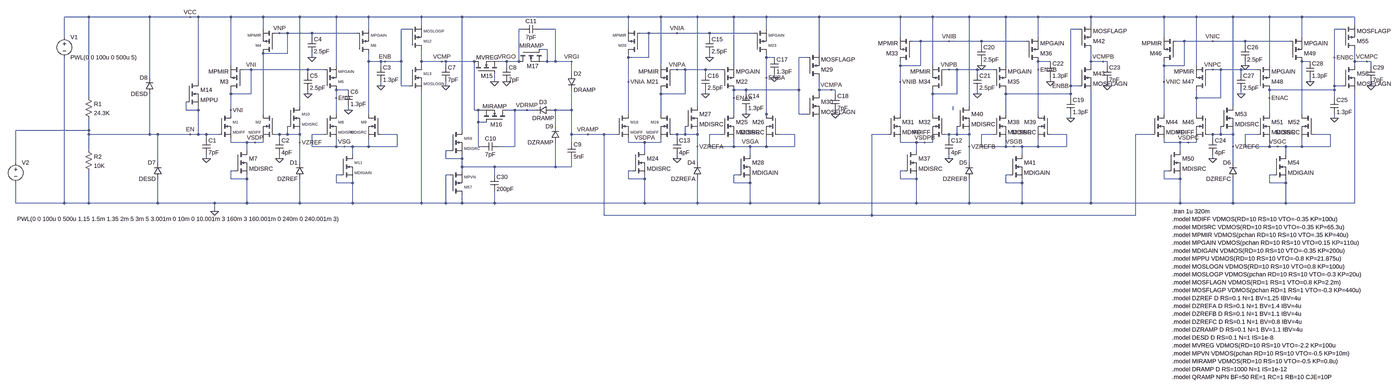
[diagram p0: schematic LM3880.asc, whole sheet]
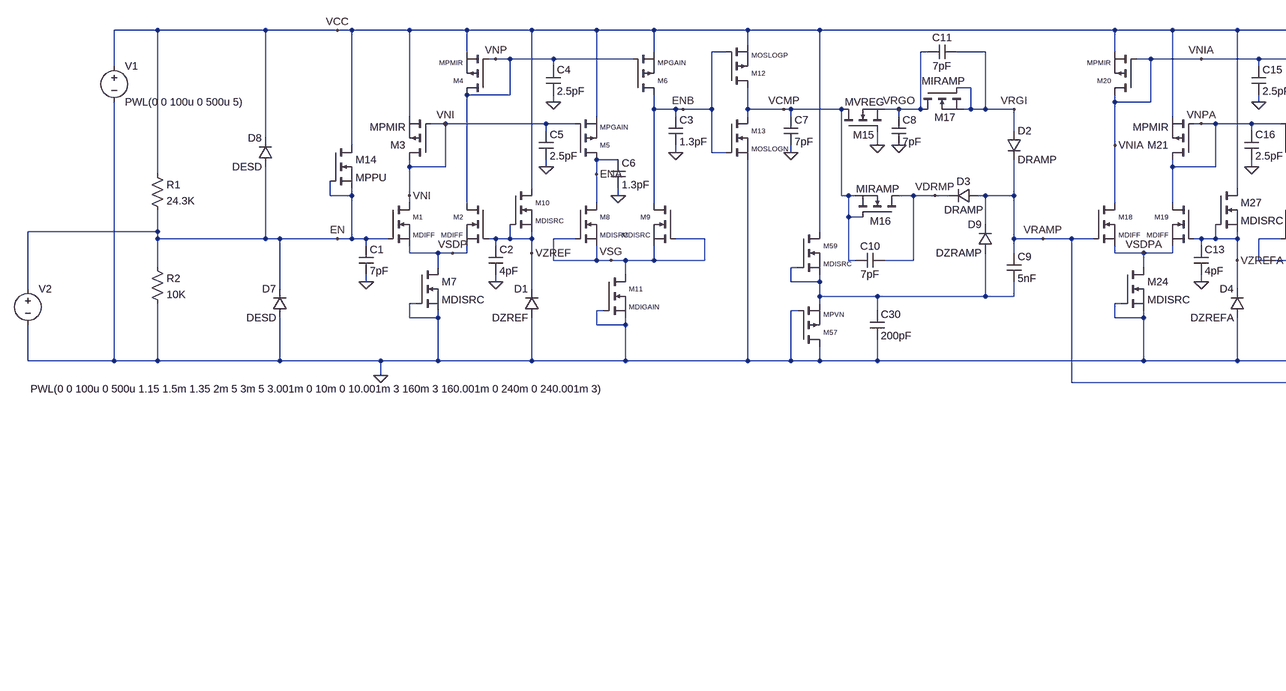
[diagram p1: schematic LM3880.asc, part, row 1 of 1, column 1 of 2]
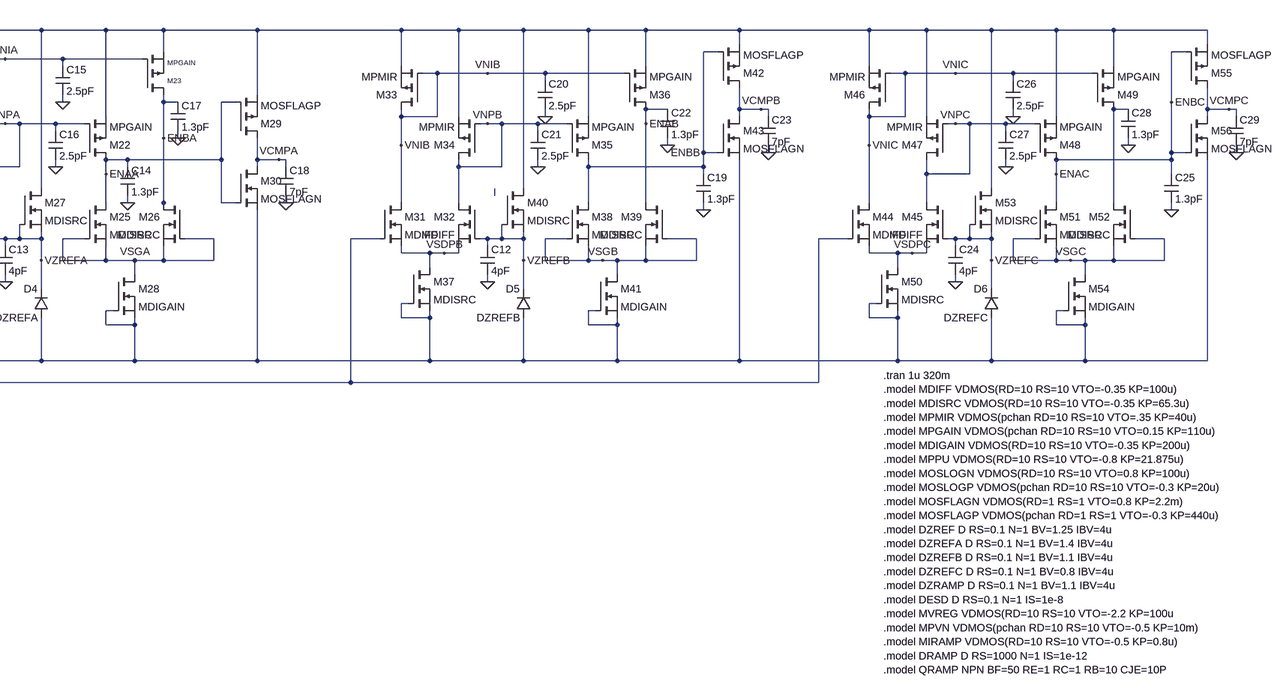
[diagram p2: schematic LM3880.asc, part, row 1 of 1, column 2 of 2]
LM3880.asc, the LTspice schematic file:
Version 4
SHEET 1 4836 1028
WIRE -320 -272 -416 -272
WIRE -80 -272 -320 -272
WIRE 80 -272 -80 -272
WIRE 112 -272 80 -272
WIRE 240 -272 112 -272
WIRE 368 -272 240 -272
WIRE 512 -272 368 -272
WIRE 656 -272 512 -272
WIRE 784 -272 656 -272
WIRE 992 -272 784 -272
WIRE 1152 -272 992 -272
WIRE 1808 -272 1152 -272
WIRE 1936 -272 1808 -272
WIRE 2080 -272 1936 -272
WIRE 2224 -272 2080 -272
WIRE 2352 -272 2224 -272
WIRE 2560 -272 2352 -272
WIRE 2880 -272 2560 -272
WIRE 3008 -272 2880 -272
WIRE 3152 -272 3008 -272
WIRE 3296 -272 3152 -272
WIRE 3424 -272 3296 -272
WIRE 3632 -272 3424 -272
WIRE 3920 -272 3632 -272
WIRE 4048 -272 3920 -272
WIRE 4192 -272 4048 -272
WIRE 4336 -272 4192 -272
WIRE 4464 -272 4336 -272
WIRE 4672 -272 4464 -272
WIRE 992 -240 992 -272
WIRE 3632 -240 3632 -272
WIRE 4672 -240 4672 -272
WIRE 368 -224 368 -272
WIRE 784 -224 784 -272
WIRE 944 -224 912 -224
WIRE 1392 -224 1376 -224
WIRE 1520 -224 1456 -224
WIRE 1808 -224 1808 -272
WIRE 2352 -224 2352 -272
WIRE 3584 -224 3552 -224
WIRE 4624 -224 4592 -224
WIRE 432 -208 416 -208
WIRE 464 -208 432 -208
WIRE 560 -208 464 -208
WIRE 736 -208 560 -208
WIRE 1888 -208 1856 -208
WIRE 2000 -208 1888 -208
WIRE 2128 -208 2000 -208
WIRE 2304 -208 2128 -208
WIRE -416 -192 -416 -272
WIRE 560 -192 560 -208
WIRE 2128 -192 2128 -208
WIRE 2880 -192 2880 -272
WIRE 3424 -192 3424 -272
WIRE 3920 -192 3920 -272
WIRE 4464 -192 4464 -272
WIRE 2960 -176 2928 -176
WIRE 3072 -176 2960 -176
WIRE 3200 -176 3072 -176
WIRE 3376 -176 3200 -176
WIRE 4000 -176 3968 -176
WIRE 4112 -176 4000 -176
WIRE 4240 -176 4112 -176
WIRE 4416 -176 4240 -176
WIRE 3200 -160 3200 -176
WIRE 4240 -160 4240 -176
WIRE 1488 -144 1456 -144
WIRE 464 -128 464 -208
WIRE 464 -128 368 -128
WIRE 2560 -128 2560 -272
WIRE 560 -112 560 -128
WIRE 1808 -112 1808 -128
WIRE 1888 -112 1888 -208
WIRE 1888 -112 1808 -112
WIRE 2128 -112 2128 -128
WIRE 2352 -112 2352 -128
WIRE 2384 -112 2352 -112
WIRE 2512 -112 2480 -112
WIRE 4592 -112 4592 -224
WIRE 784 -96 784 -128
WIRE 832 -96 784 -96
WIRE 848 -96 832 -96
WIRE 912 -96 912 -224
WIRE 912 -96 848 -96
WIRE 992 -96 992 -144
WIRE 1072 -96 992 -96
WIRE 1088 -96 1072 -96
WIRE 1200 -96 1088 -96
WIRE 1328 -96 1296 -96
WIRE 1376 -96 1376 -224
WIRE 1376 -96 1328 -96
WIRE 1488 -96 1488 -144
WIRE 1488 -96 1472 -96
WIRE 1520 -96 1520 -224
WIRE 1520 -96 1488 -96
WIRE 1584 -96 1520 -96
WIRE 3472 -96 3424 -96
WIRE 3632 -96 3632 -144
WIRE 3680 -96 3632 -96
WIRE 3696 -96 3680 -96
WIRE 4496 -96 4464 -96
WIRE 4672 -96 4672 -144
WIRE 4720 -96 4672 -96
WIRE 4736 -96 4720 -96
WIRE 240 -80 240 -272
WIRE 656 -80 656 -272
WIRE 832 -80 832 -96
WIRE 992 -80 992 -96
WIRE 1088 -80 1088 -96
WIRE 1328 -80 1328 -96
WIRE 1936 -80 1936 -272
WIRE 2224 -80 2224 -272
WIRE 2880 -80 2880 -96
WIRE 2960 -80 2960 -176
WIRE 2960 -80 2880 -80
WIRE 3008 -80 3008 -272
WIRE 3200 -80 3200 -96
WIRE 3296 -80 3296 -272
WIRE 3632 -80 3632 -96
WIRE 3696 -80 3696 -96
WIRE 3920 -80 3920 -96
WIRE 4000 -80 4000 -176
WIRE 4000 -80 3920 -80
WIRE 4048 -80 4048 -272
WIRE 4240 -80 4240 -96
WIRE 4336 -80 4336 -272
WIRE 4672 -80 4672 -96
WIRE 4736 -80 4736 -96
WIRE 320 -64 288 -64
WIRE 544 -64 320 -64
WIRE 608 -64 544 -64
WIRE 2000 -64 1984 -64
WIRE 2032 -64 2000 -64
WIRE 2112 -64 2032 -64
WIRE 2176 -64 2112 -64
WIRE 3072 -64 3056 -64
WIRE 3104 -64 3072 -64
WIRE 3184 -64 3104 -64
WIRE 3248 -64 3184 -64
WIRE 3424 -64 3424 -96
WIRE 4112 -64 4096 -64
WIRE 4144 -64 4112 -64
WIRE 4224 -64 4144 -64
WIRE 4288 -64 4224 -64
WIRE 544 -48 544 -64
WIRE 1584 -48 1584 -96
WIRE 2112 -48 2112 -64
WIRE 3184 -48 3184 -64
WIRE 4224 -48 4224 -64
WIRE -80 -32 -80 -272
WIRE 2352 -32 2352 -112
WIRE 2384 -32 2384 -48
WIRE 112 -16 112 -272
WIRE 1280 -16 1280 -48
WIRE 1808 -16 1808 -112
WIRE 2880 -16 2880 -80
WIRE 3472 -16 3472 -32
WIRE 3920 -16 3920 -80
WIRE 4496 -16 4496 -32
WIRE 832 0 832 -16
WIRE 912 0 912 -96
WIRE 944 0 912 0
WIRE 1088 0 1088 -16
WIRE 3552 0 3552 -224
WIRE 3584 0 3552 0
WIRE 3696 0 3696 -16
WIRE 4592 0 4592 -112
WIRE 4624 0 4592 0
WIRE 4736 0 4736 -16
WIRE 704 16 656 16
WIRE 2272 16 2224 16
WIRE 2480 16 2480 -112
WIRE 2480 16 2272 16
WIRE 2560 16 2560 -32
WIRE 2608 16 2560 16
WIRE 2624 16 2608 16
WIRE 4592 16 4592 0
WIRE 4592 16 4336 16
WIRE 240 32 240 16
WIRE 320 32 320 -64
WIRE 320 32 240 32
WIRE 544 32 544 16
WIRE 1936 32 1936 16
WIRE 2032 32 2032 -64
WIRE 2032 32 1936 32
WIRE 2112 32 2112 16
WIRE 2272 32 2272 16
WIRE 2560 32 2560 16
WIRE 2624 32 2624 16
WIRE 3008 32 3008 16
WIRE 3104 32 3104 -64
WIRE 3104 32 3008 32
WIRE 3184 32 3184 16
WIRE 3296 32 3296 16
WIRE 3552 32 3552 0
WIRE 3552 32 3296 32
WIRE 4224 32 4224 16
WIRE -320 48 -320 -272
WIRE 656 48 656 16
WIRE 2224 48 2224 16
WIRE 3552 48 3552 32
WIRE 4048 48 4048 16
WIRE 4144 48 4144 -64
WIRE 4144 48 4048 48
WIRE 4336 48 4336 16
WIRE 4592 48 4592 16
WIRE 512 80 512 -272
WIRE 2080 80 2080 -272
WIRE 3152 80 3152 -272
WIRE 4192 80 4192 -272
WIRE 64 96 64 64
WIRE 112 96 112 80
WIRE 112 96 64 96
WIRE 240 96 240 32
WIRE 704 96 704 80
WIRE 1200 96 1200 -96
WIRE 1216 96 1200 96
WIRE 1232 96 1216 96
WIRE 1360 96 1328 96
WIRE 1408 96 1360 96
WIRE 1440 96 1408 96
WIRE 1520 96 1504 96
WIRE 1584 96 1584 16
WIRE 1584 96 1520 96
WIRE 3088 96 3088 80
WIRE 240 112 240 96
WIRE 368 112 368 -128
WIRE 656 112 656 48
WIRE 784 112 784 -96
WIRE 1808 112 1808 -16
WIRE 1936 112 1936 32
WIRE 2224 112 2224 48
WIRE 2272 112 2272 96
WIRE 2352 112 2352 -32
WIRE 2480 112 2480 16
WIRE 2512 112 2480 112
WIRE 2624 112 2624 96
WIRE 2880 112 2880 -16
WIRE 3008 112 3008 32
WIRE 3296 112 3296 32
WIRE 3424 112 3424 -64
WIRE 3920 112 3920 -16
WIRE 4048 112 4048 48
WIRE 4336 112 4336 48
WIRE 4464 112 4464 -96
WIRE 2352 128 2352 112
WIRE 3552 128 3552 112
WIRE 4592 128 4592 112
WIRE 1216 144 1216 96
WIRE 1248 144 1216 144
WIRE 1520 160 1520 96
WIRE -320 176 -320 128
WIRE -320 176 -608 176
WIRE 1152 176 1152 -272
WIRE -320 192 -320 176
WIRE -80 192 -80 32
WIRE -80 192 -320 192
WIRE -48 192 -80 192
WIRE 80 192 -48 192
WIRE 112 192 112 96
WIRE 112 192 80 192
WIRE 144 192 112 192
WIRE 192 192 144 192
WIRE 432 192 416 192
WIRE 464 192 464 160
WIRE 464 192 432 192
WIRE 512 192 512 176
WIRE 512 192 464 192
WIRE 608 192 560 192
WIRE 896 192 832 192
WIRE 1584 192 1584 96
WIRE 1648 192 1584 192
WIRE 1712 192 1648 192
WIRE 1760 192 1712 192
WIRE 2000 192 1984 192
WIRE 2032 192 2032 160
WIRE 2032 192 2000 192
WIRE 2080 192 2080 176
WIRE 2080 192 2032 192
WIRE 2176 192 2128 192
WIRE 2464 192 2400 192
WIRE 2832 192 2768 192
WIRE 3072 192 3056 192
WIRE 3104 192 3104 160
WIRE 3104 192 3072 192
WIRE 3152 192 3152 176
WIRE 3152 192 3104 192
WIRE 3248 192 3200 192
WIRE 3536 192 3472 192
WIRE 3872 192 3808 192
WIRE 4112 192 4096 192
WIRE 4144 192 4144 160
WIRE 4144 192 4112 192
WIRE 4192 192 4192 176
WIRE 4192 192 4144 192
WIRE 4288 192 4240 192
WIRE 4576 192 4512 192
WIRE 144 208 144 192
WIRE 432 208 432 192
WIRE 2000 208 2000 192
WIRE 3072 208 3072 192
WIRE 4112 208 4112 192
WIRE 240 224 240 208
WIRE 304 224 240 224
WIRE 336 224 304 224
WIRE 368 224 368 208
WIRE 368 224 336 224
WIRE 512 224 512 192
WIRE 1584 224 1584 192
WIRE 1808 224 1808 208
WIRE 1872 224 1808 224
WIRE 1936 224 1936 208
WIRE 1936 224 1872 224
WIRE 2880 224 2880 208
WIRE 2944 224 2880 224
WIRE 2976 224 2944 224
WIRE 3008 224 3008 208
WIRE 3008 224 2976 224
WIRE 3920 224 3920 208
WIRE 3984 224 3920 224
WIRE 4016 224 3984 224
WIRE 4048 224 4048 208
WIRE 4048 224 4016 224
WIRE 560 240 560 192
WIRE 656 240 656 208
WIRE 656 240 560 240
WIRE 688 240 656 240
WIRE 720 240 688 240
WIRE 784 240 784 208
WIRE 784 240 720 240
WIRE 896 240 896 192
WIRE 896 240 784 240
WIRE 1216 240 1216 144
WIRE 1232 240 1216 240
WIRE 1360 240 1360 96
WIRE 1360 240 1296 240
WIRE 2080 240 2080 192
WIRE 2128 240 2128 192
WIRE 2224 240 2224 208
WIRE 2224 240 2128 240
WIRE 2288 240 2224 240
WIRE 2352 240 2352 208
WIRE 2352 240 2288 240
WIRE 2464 240 2464 192
WIRE 2464 240 2352 240
WIRE 3152 240 3152 192
WIRE 3200 240 3200 192
WIRE 3296 240 3296 208
WIRE 3296 240 3200 240
WIRE 3328 240 3296 240
WIRE 3360 240 3328 240
WIRE 3424 240 3424 208
WIRE 3424 240 3360 240
WIRE 3536 240 3536 192
WIRE 3536 240 3424 240
WIRE 4192 240 4192 192
WIRE 4240 240 4240 192
WIRE 4336 240 4336 208
WIRE 4336 240 4240 240
WIRE 4368 240 4336 240
WIRE 4400 240 4368 240
WIRE 4464 240 4464 208
WIRE 4464 240 4400 240
WIRE 4576 240 4576 192
WIRE 4576 240 4464 240
WIRE -320 256 -320 192
WIRE 304 256 304 224
WIRE 1104 256 1088 256
WIRE 1872 256 1872 224
WIRE 2944 256 2944 224
WIRE 3984 256 3984 224
WIRE 720 272 720 240
WIRE 2288 272 2288 240
WIRE 3360 272 3360 240
WIRE 4400 272 4400 240
WIRE 144 288 144 272
WIRE 432 288 432 272
WIRE 1088 288 1088 256
WIRE 1152 288 1152 272
WIRE 1152 288 1088 288
WIRE 2000 288 2000 272
WIRE 3072 288 3072 272
WIRE 4112 288 4112 272
WIRE -608 304 -608 176
WIRE -48 304 -48 192
WIRE 512 304 512 224
WIRE 2080 304 2080 240
WIRE 3152 304 3152 240
WIRE 4192 304 4192 240
WIRE 1152 320 1152 288
WIRE 1280 320 1152 320
WIRE 1520 320 1520 224
WIRE 1520 320 1280 320
WIRE 1584 320 1584 288
WIRE 1584 320 1520 320
WIRE 256 336 240 336
WIRE 1152 336 1152 320
WIRE 1824 336 1808 336
WIRE 2896 336 2880 336
WIRE 3936 336 3920 336
WIRE 672 352 656 352
WIRE 1104 352 1088 352
WIRE 1280 352 1280 320
WIRE 2240 352 2224 352
WIRE 3312 352 3296 352
WIRE 4352 352 4336 352
WIRE 240 368 240 336
WIRE 304 368 304 352
WIRE 304 368 240 368
WIRE 1808 368 1808 336
WIRE 1872 368 1872 352
WIRE 1872 368 1808 368
WIRE 2880 368 2880 336
WIRE 2944 368 2944 352
WIRE 2944 368 2880 368
WIRE 3920 368 3920 336
WIRE 3984 368 3984 352
WIRE 3984 368 3920 368
WIRE 656 384 656 352
WIRE 720 384 720 368
WIRE 720 384 656 384
WIRE 2224 384 2224 352
WIRE 2288 384 2288 368
WIRE 2288 384 2224 384
WIRE 3296 384 3296 352
WIRE 3360 384 3360 368
WIRE 3360 384 3296 384
WIRE 4336 384 4336 352
WIRE 4400 384 4400 368
WIRE 4400 384 4336 384
WIRE -608 464 -608 384
WIRE -416 464 -416 -112
WIRE -416 464 -608 464
WIRE -320 464 -320 336
WIRE -320 464 -416 464
WIRE -48 464 -48 368
WIRE -48 464 -320 464
WIRE 176 464 -48 464
WIRE 304 464 304 368
WIRE 304 464 176 464
WIRE 512 464 512 368
WIRE 512 464 304 464
WIRE 720 464 720 384
WIRE 720 464 512 464
WIRE 992 464 992 16
WIRE 992 464 720 464
WIRE 1088 464 1088 352
WIRE 1088 464 992 464
WIRE 1152 464 1152 432
WIRE 1152 464 1088 464
WIRE 1280 464 1280 416
WIRE 1280 464 1152 464
WIRE 1872 464 1872 368
WIRE 1872 464 1280 464
WIRE 2080 464 2080 368
WIRE 2080 464 1872 464
WIRE 2288 464 2288 384
WIRE 2288 464 2080 464
WIRE 2560 464 2560 128
WIRE 2560 464 2288 464
WIRE 2944 464 2944 368
WIRE 2944 464 2560 464
WIRE 3152 464 3152 368
WIRE 3152 464 2944 464
WIRE 3360 464 3360 384
WIRE 3360 464 3152 464
WIRE 3632 464 3632 16
WIRE 3632 464 3360 464
WIRE 3984 464 3984 368
WIRE 3984 464 3632 464
WIRE 4192 464 4192 368
WIRE 4192 464 3984 464
WIRE 4400 464 4400 384
WIRE 4400 464 4192 464
WIRE 4672 464 4672 16
WIRE 4672 464 4400 464
WIRE 176 496 176 464
WIRE 1712 512 1712 192
WIRE 2768 512 2768 192
WIRE 2768 512 1712 512
WIRE 3808 512 3808 192
WIRE 3808 512 2768 512
FLAG 80 192 EN
FLAG 80 -272 VCC
FLAG 848 -96 ENB
FLAG 336 224 VSDP
FLAG 240 96 VNI
FLAG 320 -64 VNI
FLAG 176 496 0
FLAG 512 224 VZREF
FLAG 656 48 ENA
FLAG 1072 -96 VCMP
FLAG 432 -208 VNP
FLAG 688 240 VSG
FLAG 144 288 0
FLAG 560 -112 0
FLAG 544 32 0
FLAG 832 0 0
FLAG 704 96 0
FLAG 432 288 0
FLAG 1280 -16 0
FLAG 1088 0 0
FLAG 1328 -16 0
FLAG 1328 -96 VRGO
FLAG 1584 -96 VRGI
FLAG 1408 96 VDRMP
FLAG 1872 224 VSDPA
FLAG 1808 -16 VNIA
FLAG 2000 -208 VNIA
FLAG 2080 240 VZREFA
FLAG 2224 48 ENAA
FLAG 2608 16 VCMPA
FLAG 2000 -64 VNPA
FLAG 2288 240 VSGA
FLAG 2128 -112 0
FLAG 2112 32 0
FLAG 2272 112 0
FLAG 2384 -32 0
FLAG 2000 288 0
FLAG 2624 112 0
FLAG 3552 0 ENBB
FLAG 2976 224 VSDPB
FLAG 2880 -16 VNIB
FLAG 3072 -176 VNIB
FLAG 3152 240 VZREFB
FLAG 3424 -64 ENAB
FLAG 3680 -96 VCMPB
FLAG 3072 -64 VNPB
FLAG 3328 240 VSGB
FLAG 3200 -80 0
FLAG 3184 32 0
FLAG 3552 128 0
FLAG 3472 -16 0
FLAG 3072 288 0
FLAG 3696 0 0
FLAG 4016 224 VSDPC
FLAG 3920 -16 VNIC
FLAG 4112 -176 VNIC
FLAG 4192 240 VZREFC
FLAG 4336 48 ENAC
FLAG 4720 -96 VCMPC
FLAG 4112 -64 VNPC
FLAG 4368 240 VSGC
FLAG 4240 -80 0
FLAG 4224 32 0
FLAG 4592 128 0
FLAG 4496 -16 0
FLAG 4112 288 0
FLAG 4736 0 0
FLAG 1648 192 VRAMP
FLAG 2352 -32 ENBA
FLAG 4592 -112 ENBC
SYMBOL nmos 192 112 R0
WINDOW 3 56 72 Left 1
WINDOW 0 56 32 Left 1
SYMATTR Value MDIFF
SYMATTR InstName M1
SYMBOL nmos 416 112 M0
WINDOW 3 56 72 Left 1
WINDOW 0 56 32 Left 1
SYMATTR Value MDIFF
SYMATTR InstName M2
SYMBOL diode 528 368 R180
WINDOW 0 24 64 Left 2
WINDOW 3 24 0 Left 2
SYMATTR InstName D1
SYMATTR Value DZREF
SYMBOL pmos 288 16 R180
WINDOW 0 56 32 Left 2
WINDOW 3 56 72 Left 2
SYMATTR InstName M3
SYMATTR Value MPMIR
SYMBOL pmos 416 -128 R180
WINDOW 0 56 32 Left 1
WINDOW 3 56 72 Left 1
SYMATTR InstName M4
SYMATTR Value MPMIR
SYMBOL pmos 608 16 M180
WINDOW 0 56 32 Left 1
WINDOW 3 56 72 Left 1
SYMATTR InstName M5
SYMATTR Value MPGAIN
SYMBOL pmos 736 -128 M180
WINDOW 0 56 32 Left 1
WINDOW 3 56 72 Left 1
SYMATTR InstName M6
SYMATTR Value MPGAIN
SYMBOL nmos 256 256 R0
SYMATTR InstName M7
SYMATTR Value MDISRC
SYMBOL nmos 608 112 R0
WINDOW 0 56 32 Left 1
WINDOW 3 56 72 Left 1
SYMATTR InstName M8
SYMATTR Value MDISRC
SYMBOL nmos 832 112 M0
WINDOW 0 56 32 Left 1
WINDOW 3 56 72 Left 1
SYMATTR InstName M9
SYMATTR Value MDISRC
SYMBOL voltage -416 -208 R0
SYMATTR InstName V1
SYMATTR Value PWL(0 0 100u 0 500u 5)
SYMBOL nmos 464 80 R0
WINDOW 0 56 32 Left 1
WINDOW 3 56 72 Left 1
SYMATTR InstName M10
SYMATTR Value MDISRC
SYMBOL res -336 32 R0
WINDOW 0 36 40 Left 2
WINDOW 3 36 76 Left 2
SYMATTR InstName R1
SYMATTR Value 24.3K
SYMBOL res -336 240 R0
WINDOW 0 36 40 Left 2
WINDOW 3 36 76 Left 2
SYMATTR InstName R2
SYMATTR Value 10K
SYMBOL nmos 672 272 R0
WINDOW 0 56 32 Left 1
WINDOW 3 56 72 Left 1
SYMATTR InstName M11
SYMATTR Value MDIGAIN
SYMBOL voltage -608 288 R0
WINDOW 3 6 238 Left 2
SYMATTR Value PWL(0 0 100u 0 500u 1.15 1.5m 1.35 2m 5 3m 5 3.001m 0 10m 0 10.001m 3 160m 3 160.001m 0 240m 0 240.001m 3)
SYMATTR InstName V2
SYMBOL pmos 944 -144 M180
WINDOW 0 56 32 Left 1
WINDOW 3 56 72 Left 1
SYMATTR InstName M12
SYMATTR Value MOSLOGP
SYMBOL nmos 944 -80 R0
WINDOW 0 56 32 Left 1
WINDOW 3 56 72 Left 1
SYMATTR InstName M13
SYMATTR Value MOSLOGN
SYMBOL nmos 64 -16 R0
WINDOW 0 56 32 Left 2
WINDOW 3 56 72 Left 2
SYMATTR InstName M14
SYMATTR Value MPPU
SYMBOL cap 128 208 R0
SYMATTR InstName C1
SYMATTR Value 7pF
SYMBOL cap 416 208 R0
SYMATTR InstName C2
SYMATTR Value 4pF
SYMBOL cap 816 -80 R0
SYMATTR InstName C3
SYMATTR Value 1.3pF
SYMBOL cap 544 -192 R0
SYMATTR InstName C4
SYMATTR Value 2.5pF
SYMBOL cap 528 -48 R0
SYMATTR InstName C5
SYMATTR Value 2.5pF
SYMBOL cap 688 16 R0
SYMATTR InstName C6
SYMATTR Value 1.3pF
SYMBOL nmos 1200 -48 R270
WINDOW 0 -9 26 VRight 2
WINDOW 3 64 8 VRight 2
SYMATTR InstName M15
SYMATTR Value MVREG
SYMBOL cap 1072 -80 R0
SYMATTR InstName C7
SYMATTR Value 7pF
SYMBOL cap 1312 -80 R0
SYMATTR InstName C8
SYMATTR Value 7pF
SYMBOL cap 1568 224 R0
SYMATTR InstName C9
SYMATTR Value 5nF
SYMBOL diode 1568 -48 R0
SYMATTR InstName D2
SYMATTR Value DRAMP
SYMBOL nmos 1328 144 M270
WINDOW 0 -9 64 VLeft 2
WINDOW 3 63 95 VLeft 2
SYMATTR InstName M16
SYMATTR Value MIRAMP
SYMBOL nmos 1376 -144 M90
WINDOW 0 66 78 VLeft 2
WINDOW 3 -15 99 VLeft 2
SYMATTR InstName M17
SYMATTR Value MIRAMP
SYMBOL diode 1504 80 R90
WINDOW 0 0 32 VBottom 2
WINDOW 3 32 32 VTop 2
SYMATTR InstName D3
SYMATTR Value DRAMP
SYMBOL cap 1296 224 R90
WINDOW 0 0 32 VBottom 2
WINDOW 3 32 32 VTop 2
SYMATTR InstName C10
SYMATTR Value 7pF
SYMBOL cap 1456 -240 R90
WINDOW 0 0 32 VBottom 2
WINDOW 3 32 32 VTop 2
SYMATTR InstName C11
SYMATTR Value 7pF
SYMBOL nmos 1760 112 R0
WINDOW 0 56 32 Left 1
WINDOW 3 56 72 Left 1
SYMATTR InstName M18
SYMATTR Value MDIFF
SYMBOL nmos 1984 112 M0
WINDOW 0 56 32 Left 1
WINDOW 3 56 72 Left 1
SYMATTR InstName M19
SYMATTR Value MDIFF
SYMBOL diode 2096 368 R180
WINDOW 0 24 64 Left 2
WINDOW 3 24 0 Left 2
SYMATTR InstName D4
SYMATTR Value DZREFA
SYMBOL pmos 1856 -128 R180
WINDOW 0 56 32 Left 1
WINDOW 3 56 72 Left 1
SYMATTR InstName M20
SYMATTR Value MPMIR
SYMBOL pmos 1984 16 R180
SYMATTR InstName M21
SYMATTR Value MPMIR
SYMBOL pmos 2176 16 M180
SYMATTR InstName M22
SYMATTR Value MPGAIN
SYMBOL pmos 2304 -128 M180
WINDOW 0 56 32 Left 1
WINDOW 3 56 72 Left 1
SYMATTR InstName M23
SYMATTR Value MPGAIN
SYMBOL nmos 1824 256 R0
SYMATTR InstName M24
SYMATTR Value MDISRC
SYMBOL nmos 2176 112 R0
SYMATTR InstName M25
SYMATTR Value MDISRC
SYMBOL nmos 2400 112 M0
SYMATTR InstName M26
SYMATTR Value MDISRC
SYMBOL nmos 2032 80 R0
SYMATTR InstName M27
SYMATTR Value MDISRC
SYMBOL nmos 2240 272 R0
SYMATTR InstName M28
SYMATTR Value MDIGAIN
SYMBOL pmos 2512 -32 M180
SYMATTR InstName M29
SYMATTR Value MOSFLAGP
SYMBOL nmos 2512 32 R0
SYMATTR InstName M30
SYMATTR Value MOSFLAGN
SYMBOL cap 1984 208 R0
SYMATTR InstName C13
SYMATTR Value 4pF
SYMBOL cap 2256 32 R0
SYMATTR InstName C14
SYMATTR Value 1.3pF
SYMBOL cap 2112 -192 R0
SYMATTR InstName C15
SYMATTR Value 2.5pF
SYMBOL cap 2096 -48 R0
SYMATTR InstName C16
SYMATTR Value 2.5pF
SYMBOL cap 2368 -112 R0
SYMATTR InstName C17
SYMATTR Value 1.3pF
SYMBOL cap 2608 32 R0
SYMATTR InstName C18
SYMATTR Value 7pF
SYMBOL nmos 2832 112 R0
SYMATTR InstName M31
SYMATTR Value MDIFF
SYMBOL nmos 3056 112 M0
SYMATTR InstName M32
SYMATTR Value MDIFF
SYMBOL diode 3168 368 R180
WINDOW 0 24 64 Left 2
WINDOW 3 24 0 Left 2
SYMATTR InstName D5
SYMATTR Value DZREFB
SYMBOL pmos 2928 -96 R180
SYMATTR InstName M33
SYMATTR Value MPMIR
SYMBOL pmos 3056 16 R180
SYMATTR InstName M34
SYMATTR Value MPMIR
SYMBOL pmos 3248 16 M180
SYMATTR InstName M35
SYMATTR Value MPGAIN
SYMBOL pmos 3376 -96 M180
SYMATTR InstName M36
SYMATTR Value MPGAIN
SYMBOL nmos 2896 256 R0
SYMATTR InstName M37
SYMATTR Value MDISRC
SYMBOL nmos 3248 112 R0
SYMATTR InstName M38
SYMATTR Value MDISRC
SYMBOL nmos 3472 112 M0
SYMATTR InstName M39
SYMATTR Value MDISRC
SYMBOL nmos 3104 80 R0
SYMATTR InstName M40
SYMATTR Value MDISRC
SYMBOL nmos 3312 272 R0
SYMATTR InstName M41
SYMATTR Value MDIGAIN
SYMBOL pmos 3584 -144 M180
SYMATTR InstName M42
SYMATTR Value MOSFLAGP
SYMBOL nmos 3584 -80 R0
SYMATTR InstName M43
SYMATTR Value MOSFLAGN
SYMBOL cap 3056 208 R0
SYMATTR InstName C12
SYMATTR Value 4pF
SYMBOL cap 3536 48 R0
SYMATTR InstName C19
SYMATTR Value 1.3pF
SYMBOL cap 3184 -160 R0
SYMATTR InstName C20
SYMATTR Value 2.5pF
SYMBOL cap 3168 -48 R0
SYMATTR InstName C21
SYMATTR Value 2.5pF
SYMBOL cap 3456 -96 R0
SYMATTR InstName C22
SYMATTR Value 1.3pF
SYMBOL cap 3680 -80 R0
SYMATTR InstName C23
SYMATTR Value 7pF
SYMBOL nmos 3872 112 R0
SYMATTR InstName M44
SYMATTR Value MDIFF
SYMBOL nmos 4096 112 M0
SYMATTR InstName M45
SYMATTR Value MDIFF
SYMBOL diode 4208 368 R180
WINDOW 0 24 64 Left 2
WINDOW 3 24 0 Left 2
SYMATTR InstName D6
SYMATTR Value DZREFC
SYMBOL pmos 3968 -96 R180
SYMATTR InstName M46
SYMATTR Value MPMIR
SYMBOL pmos 4096 16 R180
SYMATTR InstName M47
SYMATTR Value MPMIR
SYMBOL pmos 4288 16 M180
SYMATTR InstName M48
SYMATTR Value MPGAIN
SYMBOL pmos 4416 -96 M180
SYMATTR InstName M49
SYMATTR Value MPGAIN
SYMBOL nmos 3936 256 R0
SYMATTR InstName M50
SYMATTR Value MDISRC
SYMBOL nmos 4288 112 R0
SYMATTR InstName M51
SYMATTR Value MDISRC
SYMBOL nmos 4512 112 M0
SYMATTR InstName M52
SYMATTR Value MDISRC
SYMBOL nmos 4144 80 R0
SYMATTR InstName M53
SYMATTR Value MDISRC
SYMBOL nmos 4352 272 R0
SYMATTR InstName M54
SYMATTR Value MDIGAIN
SYMBOL pmos 4624 -144 M180
SYMATTR InstName M55
SYMATTR Value MOSFLAGP
SYMBOL nmos 4624 -80 R0
SYMATTR InstName M56
SYMATTR Value MOSFLAGN
SYMBOL cap 4096 208 R0
SYMATTR InstName C24
SYMATTR Value 4pF
SYMBOL cap 4576 48 R0
SYMATTR InstName C25
SYMATTR Value 1.3pF
SYMBOL cap 4224 -160 R0
SYMATTR InstName C26
SYMATTR Value 2.5pF
SYMBOL cap 4208 -48 R0
SYMATTR InstName C27
SYMATTR Value 2.5pF
SYMBOL cap 4480 -96 R0
SYMATTR InstName C28
SYMATTR Value 1.3pF
SYMBOL cap 4720 -80 R0
SYMATTR InstName C29
SYMATTR Value 7pF
SYMBOL diode -32 368 R180
WINDOW 0 24 64 Left 2
WINDOW 3 24 0 Left 2
SYMATTR InstName D7
SYMATTR Value DESD
SYMBOL diode -64 32 R180
WINDOW 0 24 64 Left 2
WINDOW 3 24 0 Left 2
SYMATTR InstName D8
SYMATTR Value DESD
SYMBOL diode 1536 224 R180
WINDOW 0 24 64 Left 2
WINDOW 3 24 0 Left 2
SYMATTR InstName D9
SYMATTR Value DZRAMP
SYMBOL pmos 1104 432 M180
WINDOW 0 56 32 Left 1
WINDOW 3 56 72 Left 1
SYMATTR InstName M57
SYMATTR Value MPVN
SYMBOL cap 1264 352 R0
SYMATTR InstName C30
SYMATTR Value 200pF
SYMBOL nmos 1104 176 R0
WINDOW 0 56 32 Left 1
WINDOW 3 56 72 Left 1
SYMATTR InstName M59
SYMATTR Value MDISRC
TEXT 3952 496 Left 2 !.tran 1u 320m\n.model MDIFF VDMOS(RD=10 RS=10 VTO=-0.35 KP=100u)\n.model MDISRC VDMOS(RD=10 RS=10 VTO=-0.35 KP=65.3u)\n.model MPMIR VDMOS(pchan RD=10 RS=10 VTO=.35 KP=40u)\n.model MPGAIN VDMOS(pchan RD=10 RS=10 VTO=0.15 KP=110u)\n.model MDIGAIN VDMOS(RD=10 RS=10 VTO=-0.35 KP=200u)\n.model MPPU VDMOS(RD=10 RS=10 VTO=-0.8 KP=21.875u)\n.model MOSLOGN VDMOS(RD=10 RS=10 VTO=0.8 KP=100u)\n.model MOSLOGP VDMOS(pchan RD=10 RS=10 VTO=-0.3 KP=20u)\n.model MOSFLAGN VDMOS(RD=1 RS=1 VTO=0.8 KP=2.2m)\n.model MOSFLAGP VDMOS(pchan RD=1 RS=1 VTO=-0.3 KP=440u)\n.model DZREF D RS=0.1 N=1 BV=1.25 IBV=4u\n.model DZREFA D RS=0.1 N=1 BV=1.4 IBV=4u\n.model DZREFB D RS=0.1 N=1 BV=1.1 IBV=4u\n.model DZREFC D RS=0.1 N=1 BV=0.8 IBV=4u\n.model DZRAMP D RS=0.1 N=1 BV=1.1 IBV=4u\n.model DESD D RS=0.1 N=1 IS=1e-8\n.model MVREG VDMOS(RD=10 RS=10 VTO=-2.2 KP=100u\n.model MPVN VDMOS(pchan RD=10 RS=10 VTO=-0.5 KP=10m)\n.model MIRAMP VDMOS(RD=10 RS=10 VTO=-0.5 KP=0.8u)\n.model DRAMP D RS=1000 N=1 IS=1e-12\n.model QRAMP NPN BF=50 RE=1 RC=1 RB=10 CJE=10P

The netlist it stands for:
* LM3880.asc
M1 VNI EN VSDP VSDP MDIFF
M2 VNP VZREF VSDP VSDP MDIFF
D1 0 VZREF DZREF
M3 VNI VNI VCC VCC MPMIR
M4 VNP VNP VCC VCC MPMIR
M5 ENA VNI VCC VCC MPGAIN
M6 ENB VNP VCC VCC MPGAIN
M7 VSDP 0 0 0 MDISRC
M8 ENA VSG VSG VSG MDISRC
M9 ENB VSG VSG VSG MDISRC
V1 VCC 0 PWL(0 0 100u 0 500u 5)
M10 VCC VZREF VZREF VZREF MDISRC
R1 VCC EN 24.3K
R2 EN 0 10K
M11 VSG 0 0 0 MDIGAIN
V2 EN 0 PWL(0 0 100u 0 500u 1.15 1.5m 1.35 2m 5 3m 5 3.001m 0 10m 0 10.001m 3 160m 3 160.001m 0 240m 0 240.001m 3)
M12 VCMP ENB VCC VCC MOSLOGP
M13 VCMP ENB 0 0 MOSLOGN
M14 VCC EN EN EN MPPU
C1 EN 0 7pF
C2 VZREF 0 4pF
C3 ENB 0 1.3pF
C4 VNP 0 2.5pF
C5 VNI 0 2.5pF
C6 ENA 0 1.3pF
M15 VCMP 0 VRGO VRGO MVREG
C7 VCMP 0 7pF
C8 VRGO 0 7pF
C9 VRAMP N003 5nF
D2 VRGI VRAMP DRAMP
M16 VDRMP VCMP VCMP VCMP MIRAMP
M17 VRGO VRGI VRGI VRGI MIRAMP
D3 VRAMP VDRMP DRAMP
C10 VDRMP VCMP 7pF
C11 VRGI VRGO 7pF
M18 VNIA VRAMP VSDPA VSDPA MDIFF
M19 VNPA VZREFA VSDPA VSDPA MDIFF
D4 0 VZREFA DZREFA
M20 VNIA VNIA VCC VCC MPMIR
M21 VNPA VNPA VCC VCC MPMIR
M22 ENAA VNPA VCC VCC MPGAIN
M23 ENBA VNIA VCC VCC MPGAIN
M24 VSDPA 0 0 0 MDISRC
M25 ENAA VSGA VSGA VSGA MDISRC
M26 ENBA VSGA VSGA VSGA MDISRC
M27 VCC VZREFA VZREFA VZREFA MDISRC
M28 VSGA 0 0 0 MDIGAIN
M29 VCMPA ENAA VCC VCC MOSFLAGP
M30 VCMPA ENAA 0 0 MOSFLAGN
C13 VZREFA 0 4pF
C14 ENAA 0 1.3pF
C15 VNIA 0 2.5pF
C16 VNPA 0 2.5pF
C17 ENBA 0 1.3pF
C18 VCMPA 0 7pF
M31 VNIB VRAMP VSDPB VSDPB MDIFF
M32 VNPB VZREFB VSDPB VSDPB MDIFF
D5 0 VZREFB DZREFB
M33 VNIB VNIB VCC VCC MPMIR
M34 VNPB VNPB VCC VCC MPMIR
M35 ENBB VNPB VCC VCC MPGAIN
M36 ENAB VNIB VCC VCC MPGAIN
M37 VSDPB 0 0 0 MDISRC
M38 ENBB VSGB VSGB VSGB MDISRC
M39 ENAB VSGB VSGB VSGB MDISRC
M40 VCC VZREFB VZREFB VZREFB MDISRC
M41 VSGB 0 0 0 MDIGAIN
M42 VCMPB ENBB VCC VCC MOSFLAGP
M43 VCMPB ENBB 0 0 MOSFLAGN
C12 VZREFB 0 4pF
C19 ENBB 0 1.3pF
C20 VNIB 0 2.5pF
C21 VNPB 0 2.5pF
C22 ENAB 0 1.3pF
C23 VCMPB 0 7pF
M44 VNIC VRAMP VSDPC VSDPC MDIFF
M45 VNPC VZREFC VSDPC VSDPC MDIFF
D6 0 VZREFC DZREFC
M46 VNIC VNIC VCC VCC MPMIR
M47 VNPC VNPC VCC VCC MPMIR
M48 ENBC VNPC VCC VCC MPGAIN
M49 N001 VNIC VCC VCC MPGAIN
M50 VSDPC 0 0 0 MDISRC
M51 ENBC VSGC VSGC VSGC MDISRC
M52 N001 VSGC VSGC VSGC MDISRC
M53 VCC VZREFC VZREFC VZREFC MDISRC
M54 VSGC 0 0 0 MDIGAIN
M55 VCMPC ENBC VCC VCC MOSFLAGP
M56 VCMPC ENBC 0 0 MOSFLAGN
C24 VZREFC 0 4pF
C25 ENBC 0 1.3pF
C26 VNIC 0 2.5pF
C27 VNPC 0 2.5pF
C28 N001 0 1.3pF
C29 VCMPC 0 7pF
D7 0 EN DESD
D8 EN VCC DESD
D9 N003 VRAMP DZRAMP
M57 0 0 N003 N003 MPVN
C30 N003 0 200pF
M59 VCC N003 N003 N003 MDISRC
.model D D
.lib standard.dio
.model NMOS NMOS
.model PMOS PMOS
.lib standard.mos
.tran 1u 320m
.model MDIFF VDMOS(RD=10 RS=10 VTO=-0.35 KP=100u)
.model MDISRC VDMOS(RD=10 RS=10 VTO=-0.35 KP=65.3u)
.model MPMIR VDMOS(pchan RD=10 RS=10 VTO=.35 KP=40u)
.model MPGAIN VDMOS(pchan RD=10 RS=10 VTO=0.15 KP=110u)
.model MDIGAIN VDMOS(RD=10 RS=10 VTO=-0.35 KP=200u)
.model MPPU VDMOS(RD=10 RS=10 VTO=-0.8 KP=21.875u)
.model MOSLOGN VDMOS(RD=10 RS=10 VTO=0.8 KP=100u)
.model MOSLOGP VDMOS(pchan RD=10 RS=10 VTO=-0.3 KP=20u)
.model MOSFLAGN VDMOS(RD=1 RS=1 VTO=0.8 KP=2.2m)
.model MOSFLAGP VDMOS(pchan RD=1 RS=1 VTO=-0.3 KP=440u)
.model DZREF D RS=0.1 N=1 BV=1.25 IBV=4u
.model DZREFA D RS=0.1 N=1 BV=1.4 IBV=4u
.model DZREFB D RS=0.1 N=1 BV=1.1 IBV=4u
.model DZREFC D RS=0.1 N=1 BV=0.8 IBV=4u
.model DZRAMP D RS=0.1 N=1 BV=1.1 IBV=4u
.model DESD D RS=0.1 N=1 IS=1e-8
.model MVREG VDMOS(RD=10 RS=10 VTO=-2.2 KP=100u
.model MPVN VDMOS(pchan RD=10 RS=10 VTO=-0.5 KP=10m)
.model MIRAMP VDMOS(RD=10 RS=10 VTO=-0.5 KP=0.8u)
.model DRAMP D RS=1000 N=1 IS=1e-12
.model QRAMP NPN BF=50 RE=1 RC=1 RB=10 CJE=10P
.backanno
.end